# Altium project powerdriver.PrjPCB
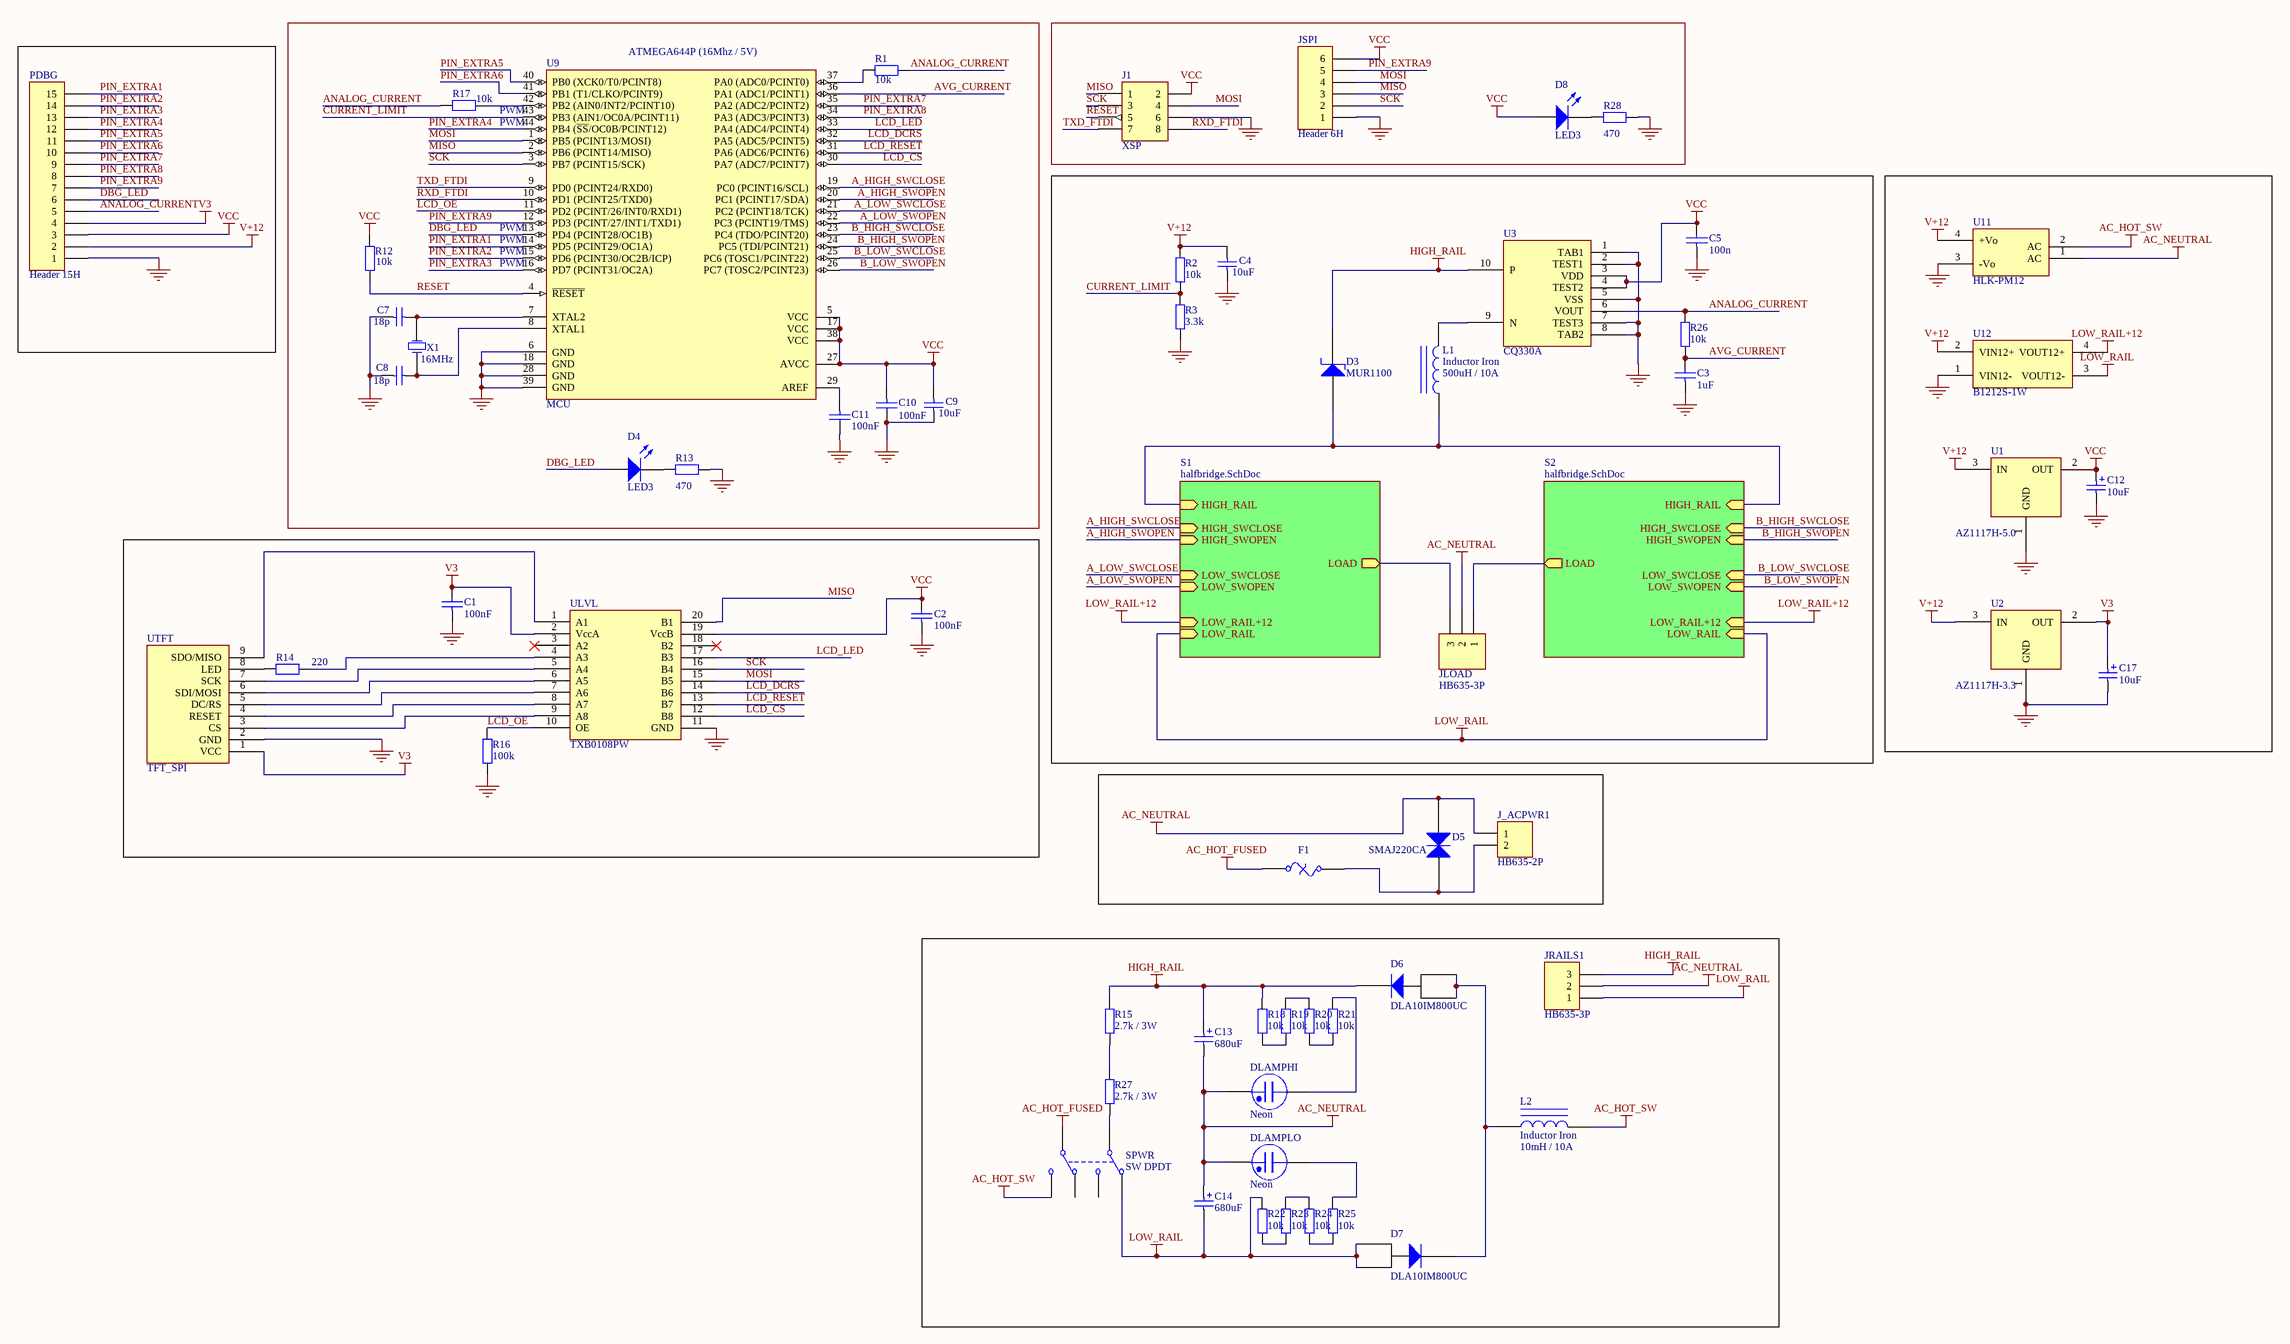
[diagram p0: powerdriver.SchDoc]
2 sheets, 99 parts. Net scope: hierarchical (ports join the sheet entries above them; power ports are global).
Board file: powerdriver.PcbDoc
Sheets:
  powerdriver.SchDoc
    S1 = halfbridge.SchDoc
    S2 = halfbridge.SchDoc

## Sheet powerdriver.SchDoc
size C

### Parts
C1  100nF  [CAPC1608N]
C2  100nF  [CAPC1608N]
C3  1uF  [CAPC1608N]
C4  10uF  [CAPC3216L]
C5  100n  [CAPC1608N]
C7  18p  [CAPC1608L]
C8  18p  [CAPC1608L]
C9  10uF  [CAPC3216L]
C10  100nF  [CAPC1608N]
C11  100nF  [CAPC1608N]
C12  10uF  [CAPC2012N]
C13  value 680uF  [Cap_450v_680uF]  (hidden comment: Cap Pol3)
C14  value 680uF  [Cap_450v_680uF]  (hidden comment: Cap Pol3)
C17  10uF  [CAPC2012N]
D3  MUR1100  [DIODE-0.4]
D4  LED3  [CAPC1608N]
D5  SMAJ220CA  [SMAJ220CA]
D6  DLA10IM800UC  [DLA10IM800UC]
D7  DLA10IM800UC  [DLA10IM800UC]
D8  LED3  [CAPC1608N]
DLAMPHI  Neon  [NEON]
DLAMPLO  Neon  [NEON]
F1  (no value)  [FuseHolder]
J1  XSP  [HDR2X4H]
J_ACPWR1  HB635-2P  [SCREW_TERM_2]
JLOAD  HB635-3P  [SCREW_TERM_3]
JRAILS1  HB635-3P  [SCREW_TERM_3]
JSPI  Header 6H  [HDR1X6H]
L1  Inductor Iron  value 500uH / 10A  [BigInductor]
L2  Inductor Iron  value 10mH / 10A  [BigInductor]
PDBG  Header 15H  [HDR1X15H]
R1  10k  [RESC1608N]
R2  10k  [RESC1608N]
R3  3.3k  [RESC1608N]
R12  10k  [RESC1608N]
R13  470  [RESC1608N]
R14  220  [RESC1608N]
R15  2.7k / 3W  [AXIAL-1.0]
R16  100k  [RESC1608N]
R17  10k  [RESC1608N]
R18  10k  [RESC3225N]
R19  10k  [RESC3225N]
R20  10k  [RESC3225N]
R21  10k  [RESC3225N]
R22  10k  [CAPC3225N]
R23  10k  [RESC3225N]
R24  10k  [RESC3225N]
R25  10k  [RESC3225N]
R26  10k  [RESC1608N]
R27  2.7k / 3W  [AXIAL-1.0]
R28  470  [RESC1608N]
SPWR  SW DPDT  [KCD2-202N]
U1  AZ1117H-5.0  [AZ1117H]
U2  AZ1117H-3.3  [AZ1117H]
U3  CQ330A  [CQ330A]
U9  MCU  [atmega644p]
U11  HLK-PM12  [HLK-PM01]
U12  B1212S-1W  [B1212S-1W]
ULVL  TXB0108PW  [TXB0108PW]
UTFT  TFT_SPI  [TFTLCD]
X1  16MHz  [XTAL]

### Sub-sheets
S1 = halfbridge.SchDoc: LOAD (out), HIGH_SWCLOSE (in), HIGH_SWOPEN (in), LOW_SWCLOSE (in), LOW_SWOPEN (in), HIGH_RAIL (in), LOW_RAIL (in), LOW_RAIL+12 (in)
S2 = halfbridge.SchDoc: LOAD (out), HIGH_SWCLOSE (in), HIGH_SWOPEN (in), LOW_SWCLOSE (in), LOW_SWOPEN (in), HIGH_RAIL (in), LOW_RAIL (in), LOW_RAIL+12 (in)

### Nets
AC_HOT_FUSED: F1.1 SPWR.5(COMMON2)
AC_HOT_SW: L2.2 SPWR.6(NO2) U11.2(AC)
AC_NEUTRAL: C13.2 C14.1 D5.2 DLAMPHI.1 DLAMPLO.1 J_ACPWR1.1 JLOAD.2 JRAILS1.2 U11.1(AC)
GND: C1.1 C2.1 C3.1 C4.1 C5.1 C7.1 C8.1 C9.1 C10.2 C11.2 C12.2 C17.2 J1.6 JSPI.1 PDBG.1 R3.1 R13.2 R16.1 R28.2 U1.1(GND) U2.1(GND) U3.1(TAB1) U3.2(TEST1) U3.5(VSS) U3.7(TEST3) U3.8(TAB2) U9.6(GND) U9.18(GND) U9.28(GND) U9.39(GND) U11.3(-Vo) U12.1(VIN12-) ULVL.11(GND) UTFT.2(GND)
HIGH_RAIL: C13.1 D3.2 D6.4 JRAILS1.3 R15.1 R18.2 U3.10(P)
LOW_RAIL: C14.2 D7.1 D7.3 JRAILS1.1 R22.1 SPWR.2(NC1) U12.3(VOUT12-) ; sheet S1/LOW_RAIL, sheet S2/LOW_RAIL
LOW_RAIL+12: U12.4(VOUT12+) ; sheet S1/LOW_RAIL+12, sheet S2/LOW_RAIL+12
V3: C1.2 C17.1 PDBG.4 U2.2(OUT) ULVL.2(VccA) UTFT.1(VCC)
V+12: C4.2 PDBG.2 R2.2 U1.3(IN) U2.3(IN) U11.4(+Vo) U12.2(VIN12+)
VCC: C2.2 C5.2 C9.2 C10.1 C12.1 D8.1(A) J1.2 JSPI.6 PDBG.3 R12.1 U1.2(OUT) U3.3(VDD) U3.4(TEST2) U9.5(VCC) U9.17(VCC) U9.27(AVCC) U9.38(VCC) ULVL.19(VccB)
A_HIGH_SWCLOSE: U9.19(PC0_(PCINT16/SCL)) ; sheet S1/HIGH_SWCLOSE
A_HIGH_SWOPEN: U9.20(PC1_(PCINT17/SDA)) ; sheet S1/HIGH_SWOPEN
A_LOW_SWCLOSE: U9.21(PC2_(PCINT18/TCK)) ; sheet S1/LOW_SWCLOSE
A_LOW_SWOPEN: U9.22(PC3_(PCINT19/TMS)) ; sheet S1/LOW_SWOPEN
ANALOG_CURRENT: PDBG.5 R1.1 R17.2 R26.1 U3.6(VOUT)
AVG_CURRENT: C3.2 R26.2 U9.36(PA1_(ADC1/PCINT1))
B_HIGH_SWCLOSE: U9.23(PC4_(TDO/PCINT20)) ; sheet S2/HIGH_SWCLOSE
B_HIGH_SWOPEN: U9.24(PC5_(TDI/PCINT21)) ; sheet S2/HIGH_SWOPEN
B_LOW_SWCLOSE: U9.25(PC6_(TOSC1/PCINT22)) ; sheet S2/LOW_SWCLOSE
B_LOW_SWOPEN: U9.26(PC7_(TOSC2/PCINT23)) ; sheet S2/LOW_SWOPEN
CURRENT_LIMIT: R2.1 R3.2 U9.43(PB3_(AIN1/OC0A/PCINT11))
DBG_LED: D4.1(A) PDBG.6 U9.13(PD4_(PCINT28/OC1B))
LCD_CS: U9.30(PA7_(ADC7/PCINT7)) ULVL.12(B8)
LCD_DCRS: U9.32(PA5_(ADC5/PCINT5)) ULVL.14(B6)
LCD_LED: U9.33(PA4_(ADC4/PCINT4)) ULVL.17(B3)
LCD_OE: R16.2 U9.11(PD2_(PCINT/26/INT0/RXD1)) ULVL.10(OE)
LCD_RESET: U9.31(PA6_(ADC6/PCINT6)) ULVL.13(B7)
LOAD: JLOAD.1 ; sheet S2/LOAD
LOAD: JLOAD.3 ; sheet S1/LOAD  [a separate net that carries the same name]
MISO: J1.1 JSPI.3 U9.2(PB6_(PCINT14/MISO)) ULVL.20(B1)
MOSI: J1.4 JSPI.4 U9.1(PB5_(PCINT13/MOSI)) ULVL.15(B5)
PIN_EXTRA1: PDBG.15 U9.14(PD5_(PCINT29/OC1A))
PIN_EXTRA2: PDBG.14 U9.15(PD6_(PCINT30/OC2B/ICP))
PIN_EXTRA3: PDBG.13 U9.16(PD7_(PCINT31/OC2A))
PIN_EXTRA4: PDBG.12 U9.44(PB4_(~{SS}/OC0B/PCINT12))
PIN_EXTRA5: PDBG.11 U9.40(PB0_(XCK0/T0/PCINT8))
PIN_EXTRA6: PDBG.10 U9.41(PB1_(T1/CLKO/PCINT9))
PIN_EXTRA7: PDBG.9 U9.35(PA2_(ADC2/PCINT2))
PIN_EXTRA8: PDBG.8 U9.34(PA3_(ADC3/PCINT3))
PIN_EXTRA9: JSPI.5 PDBG.7 U9.12(PD3_(PCINT/27/INT1/TXD1))
RESET: J1.5 R12.2 U9.4(~{RESET})
RXD_FTDI: J1.8 U9.10(PD1_(PCINT25/TXD0))
SCK: J1.3 JSPI.2 U9.3(PB7_(PCINT15/SCK)) ULVL.16(B4)
TXD_FTDI: J1.7 U9.9(PD0_(PCINT24/RXD0))
NetC7_2: C7.2 U9.7(XTAL2) X1.2(OSC2)
NetC8_2: C8.2 U9.8(XTAL1) X1.1(OSC1)
NetC11_1: C11.1 U9.29(AREF)
NetD1_S1_2: D3.1 L1.1 ; sheet S1/HIGH_RAIL, sheet S2/HIGH_RAIL
NetD4_2: D4.2(K) R13.1
NetD5_1: D5.1 F1.2 J_ACPWR1.2
NetD6_1: D6.1 D6.3 D7.4 L2.1
NetD8_2: D8.2(K) R28.1
NetDLAMPHI_2: DLAMPHI.2 R21.2
NetDLAMPLO_2: DLAMPLO.2 R25.1
NetL1_2: L1.2 U3.9(N)
NetR1_2: R1.2 U9.37(PA0_(ADC0/PCINT0))
NetR14_1: R14.1 UTFT.8(LED)
NetR14_2: R14.2 ULVL.4(A3)
NetR15_2: R15.2 R27.1
NetR17_1: R17.1 U9.42(PB2_(AIN0/INT2/PCINT10))
NetR18_1: R18.1 R19.2
NetR19_1: R19.1 R20.2
NetR20_1: R20.1 R21.1
NetR22_2: R22.2 R23.2
NetR23_1: R23.1 R24.2
NetR24_1: R24.1 R25.2
NetR27_2: R27.2 SPWR.1(COMMON1)
NetULVL_1: ULVL.1(A1) UTFT.9(SDO/MISO)
NetULVL_5: ULVL.5(A4) UTFT.7(SCK)
NetULVL_6: ULVL.6(A5) UTFT.6(SDI/MOSI)
NetULVL_7: ULVL.7(A6) UTFT.5(DC/RS)
NetULVL_8: ULVL.8(A7) UTFT.4(RESET)
NetULVL_9: ULVL.9(A8) UTFT.3(CS)

Not connected (* = marked no-connect by the designer): SPWR 3(NO1) 4(NC2); ULVL 3(A2)* 18(B2)*

### Notes on the sheet
- (near U9) ATMEGA644P (16Mhz / 5V)
- PWM
- (near U9) PWM

### Library data of the parts
C1-C3 C5 C10 C11 = CAP: Capacitor
C4 C7-C9 = Cap: Capacitor; Published: 8-Jun-2000; LatestRevisionDate: 17-Jul-2002; LatestRevisionNote: Re-released for DXP Platform.; PackageReference: RAD-0.3; Publisher: Altium Limited
  C4 C9: PackageDescription: Radial Cap, Thru-Hole; 2 Leads; 0.3 in Pin Spacing; Value: 10uF
  C7 C8: Value: 18p
C12 C17 = Cap Pol2: Polarized Capacitor (Axial); Published: 8-Jun-2000; LatestRevisionDate: 17-Jul-2002; LatestRevisionNote: Re-released for DXP Platform.; PackageReference: POLAR0.8; Publisher: Altium Limited; Value: 10uF
C13 C14 = Cap Pol3: Polarized Capacitor (Surface Mount); Published: 8-Jun-2000; LatestRevisionDate: 29-May-2009; LatestRevisionNote: IPC-7351 Footprint Added.; PackageReference: C0805; Publisher: Altium Limited; PackageDescription: Chip Capacitor
D4 D8 = LED3: Typical BLUE SiC LED; Published: 8-Jun-2000; LatestRevisionDate: 17-Dec-2003; LatestRevisionNote: PCB Footprint replaced.; DatasheetVersion: 16-Apr-2002; PackageVersion: 16-Apr-2002; PackageReference: 3.5X2.8X1.9; Publisher: Altium Limited
DLAMPHI DLAMPLO = Neon: Neon Bulb; Published: 24-Mar-1999; LatestRevisionDate: 17-Jul-2002; LatestRevisionNote: Re-released for DXP Platform.; PackageReference: PIN2; Publisher: Altium Limited
F1 = Fuse Thermal: Thermal Fuse; Published: 24-Mar-1999; LatestRevisionDate: 17-Jul-2002; LatestRevisionNote: Re-released for DXP Platform.; PackageReference: PIN-W2/E2.8; Publisher: Altium Limited
J1 = Header 4X2H: Header, 4-Pin, Dual row, Right Angle; LatestRevisionDate: 17-Jul-2002; LatestRevisionNote: Re-released for DXP Platform.; Publisher: Altium Limited
J_ACPWR1 = Header 2: Header, 2-Pin; LatestRevisionDate: 17-Jul-2002; LatestRevisionNote: Re-released for DXP Platform.; Publisher: Altium Limited
JLOAD JRAILS1 = Header 3: Header, 3-Pin; LatestRevisionDate: 17-Jul-2002; LatestRevisionNote: Re-released for DXP Platform.; Publisher: Altium Limited
JSPI = Header 6H: Header, 6-Pin, Right Angle; LatestRevisionDate: 17-Jul-2002; LatestRevisionNote: Re-released for DXP Platform.; Publisher: Altium Limited
L1 L2 = Inductor Iron: Magnetic-Core Inductor; Published: 24-Mar-1999; LatestRevisionDate: 17-Jul-2002; LatestRevisionNote: Re-released for DXP Platform.; PackageReference: AXIAL-0.9; Publisher: Altium Limited
PDBG = Header 15H: Header, 15-Pin, Right Angle; LatestRevisionDate: 17-Jul-2002; LatestRevisionNote: Re-released for DXP Platform.; Publisher: Altium Limited
R1-R3 R12-R28 = Res2: Resistor; Published: 8-Jun-2000; LatestRevisionDate: 17-Jul-2002; LatestRevisionNote: Re-released for DXP Platform.; PackageReference: AXIAL-0.4; Publisher: Altium Limited
  R1 R2 R12 R17-R26: Value: 10k
  R3: Value: 3.3k
  R13 R28: Value: 470
  R14: Value: 220
  R15 R27: Value: 2.7k / 3W
  R16: Value: 100k
SPWR = SW DPDT: Switch; Published: 24-Mar-1999; LatestRevisionDate: 29-May-2009; LatestRevisionNote: IPC-7351 Footprint Added.; PackageVersion: Mar-2001; PackageReference: SOT23-6; Publisher: Altium Limited; PackageDescription: 6-Pin SOT-23 Package 0.95 mm Pitch, 2.7 mm Lead Span; Code_JEITA: SC-74; Code_IPC: SOT26A-6
U1 U2 = AZ1117H
U9 = ATmega644-20AU: 8-bit AVR Microcontroller, 2.7-5.5V, 20MHz, 64KB Flash, 2KB EEPROM, 4KB SRAM, 44-pin TQFP; DatasheetVersion: revN, Jul-2010; PackageVersion: revC, Oct-2010; PackageReference: 44A; PackageDescription: 44-Pin Plastic Thin Profile Quad Flat Pack, 10 x 10 x 1.0 mm Body, 0.8 mm Pitch (TQFP); Code_JEDEC: MS-026-ACB; ComponentLink1Description: Manufacturer URL; ComponentLink1URL: http://www.atmel.com/; ComponentLink2Description: ATmega644 Datasheet; ComponentLink2URL: http://www.atmel.com/dyn/resources/prod_documents/doc2593.pdf; ComponentLink3Description: ATmega644 Summary; ComponentLink3URL: http://www.atmel.com/dyn/resources/prod_documents/2593S.pdf
X1 = XTAL: Crystal Oscillator; Published: 8-Jun-2000; LatestRevisionDate: 17-Jul-2002; LatestRevisionNote: Re-released for DXP Platform.; PackageReference: R38; Publisher: Altium Limited

## Sheet halfbridge.SchDoc
size B
Used 2 times, as channels S1, S2. Parts and nets are listed once, with the designators drawn on the sheet.
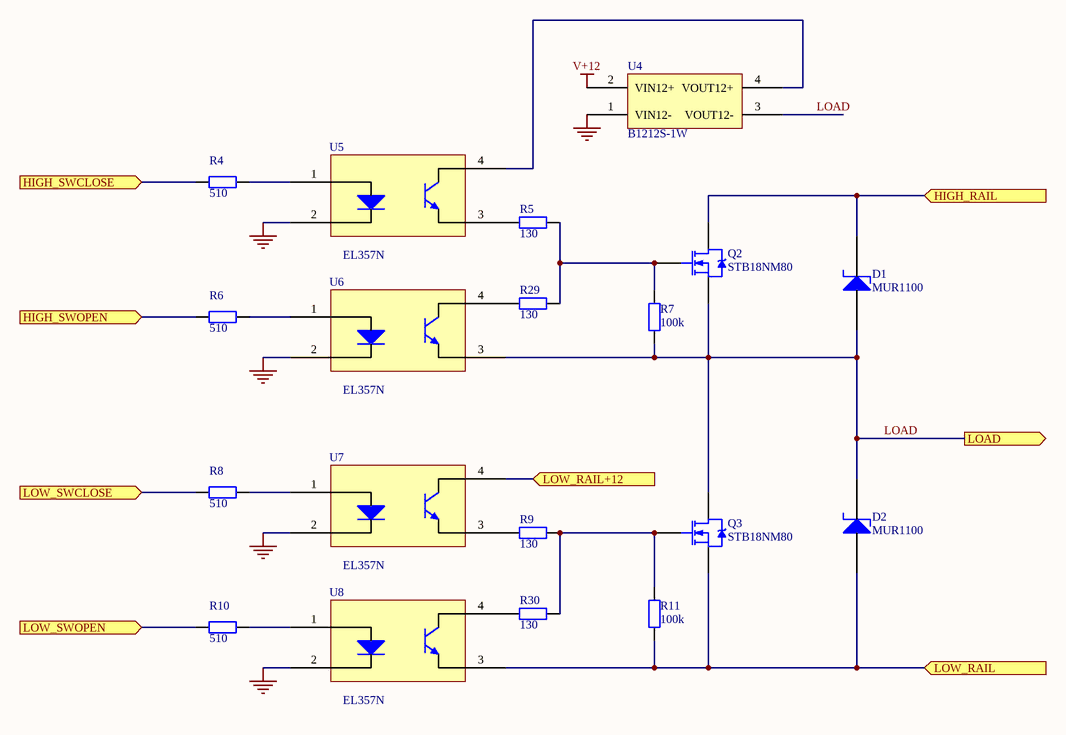
[diagram p1: halfbridge.SchDoc]

### Parts
D1  MUR1100  [DIODE-0.4]
D2  MUR1100  [DIODE-0.4]
Q2  STB18NM80  [STB18NM80]
Q3  STB18NM80  [STB18NM80]
R4  510  [RESC1608L]
R5  130  [RESC1608L]
R6  510  [RESC1608L]
R7  100k  [RESC1608L]
R8  510  [RESC1608L]
R9  130  [RESC1608L]
R10  510  [RESC1608L]
R11  100k  [RESC1608L]
R29  130  [RESC1608L]
R30  130  [RESC1608L]
U4  B1212S-1W  [B1212S-1W]
U5  EL357N  [EL357N]
U6  EL357N  [EL357N]
U7  EL357N  [EL357N]
U8  EL357N  [EL357N]

### Ports
HIGH_RAIL (in), HIGH_SWCLOSE (in), HIGH_SWOPEN (in), LOAD (out), LOW_RAIL (in), LOW_RAIL+12 (in), LOW_SWCLOSE (in), LOW_SWOPEN (in)

### Nets
GND: U4.1(VIN12-) U5.2(Cathode) U6.2(Cathode) U7.2(Cathode) U8.2(Cathode)
V+12: U4.2(VIN12+)
HIGH_RAIL: D1.2 Q2.2(D) ; port HIGH_RAIL
HIGH_SWCLOSE: R4.1 ; port HIGH_SWCLOSE
HIGH_SWOPEN: R6.1 ; port HIGH_SWOPEN
LOAD: D1.1 D2.2 Q2.3(S) Q3.2(D) R7.1 U4.3(VOUT12-) U6.3(Emitter) ; port LOAD
LOW_RAIL: D2.1 Q3.3(S) R11.1 U8.3(Emitter) ; port LOW_RAIL
LOW_RAIL+12: U7.4(Collector) ; port LOW_RAIL+12
LOW_SWCLOSE: R8.1 ; port LOW_SWCLOSE
LOW_SWOPEN: R10.1 ; port LOW_SWOPEN
NetQ2_1: Q2.1(G) R5.2 R7.2 R29.2
NetQ3_1: Q3.1(G) R9.2 R11.2 R30.2
NetR4_2: R4.2 U5.1(Anode)
NetR5_1: R5.1 U5.3(Emitter)
NetR6_2: R6.2 U6.1(Anode)
NetR8_2: R8.2 U7.1(Anode)
NetR9_1: R9.1 U7.3(Emitter)
NetR10_2: R10.2 U8.1(Anode)
NetR29_1: R29.1 U6.4(Collector)
NetR30_1: R30.1 U8.4(Collector)
NetU4_4: U4.4(VOUT12+) U5.4(Collector)

### Channels
S1: designators end in _S1; ports HIGH_RAIL=NetD1_S1_2 HIGH_SWCLOSE=A_HIGH_SWCLOSE HIGH_SWOPEN=A_HIGH_SWOPEN LOAD=LOAD LOW_RAIL+12=LOW_RAIL+12 LOW_RAIL=LOW_RAIL LOW_SWCLOSE=A_LOW_SWCLOSE LOW_SWOPEN=A_LOW_SWOPEN
S2: designators end in _S2; ports HIGH_RAIL=NetD1_S1_2 HIGH_SWCLOSE=B_HIGH_SWCLOSE HIGH_SWOPEN=B_HIGH_SWOPEN LOAD=LOAD LOW_RAIL+12=LOW_RAIL+12 LOW_RAIL=LOW_RAIL LOW_SWCLOSE=B_LOW_SWCLOSE LOW_SWOPEN=B_LOW_SWOPEN

### Library data of the parts
R4-R11 R29 R30 = Res2: Resistor; Published: 8-Jun-2000; LatestRevisionDate: 17-Jul-2002; LatestRevisionNote: Re-released for DXP Platform.; PackageReference: AXIAL-0.4; Publisher: Altium Limited
  R4 R6 R8 R10: Value: 510
  R5 R9 R29 R30: Value: 130
  R7 R11: Value: 100k
U5-U8 = EL367N

## Nets that join several sheets
GND: powerdriver (34 pins), S1 (5 pins), S2 (5 pins)
LOW_RAIL: powerdriver (7 pins), S1 (D2_S1.1 Q3_S1.3 R11_S1.1 U8_S1.3), S2 (D2_S2.1 Q3_S2.3 R11_S2.1 U8_S2.3)
LOW_RAIL+12: powerdriver (U12.4), S1 (U7_S1.4), S2 (U7_S2.4)
V+12: powerdriver (7 pins), S1 (U4_S1.2), S2 (U4_S2.2)
A_HIGH_SWCLOSE: powerdriver (U9.19), S1 (R4_S1.1)
A_HIGH_SWOPEN: powerdriver (U9.20), S1 (R6_S1.1)
A_LOW_SWCLOSE: powerdriver (U9.21), S1 (R8_S1.1)
A_LOW_SWOPEN: powerdriver (U9.22), S1 (R10_S1.1)
B_HIGH_SWCLOSE: powerdriver (U9.23), S2 (R4_S2.1)
B_HIGH_SWOPEN: powerdriver (U9.24), S2 (R6_S2.1)
B_LOW_SWCLOSE: powerdriver (U9.25), S2 (R8_S2.1)
B_LOW_SWOPEN: powerdriver (U9.26), S2 (R10_S2.1)
LOAD: powerdriver (JLOAD.1), S2 (7 pins)
LOAD: powerdriver (JLOAD.3), S1 (7 pins)
NetD1_S1_2: powerdriver (D3.1 L1.1), S1 (D1_S1.2 Q2_S1.2), S2 (D1_S2.2 Q2_S2.2)